# Altium schematic sheet Electromagnetic Detection Board.SchDoc
size A4
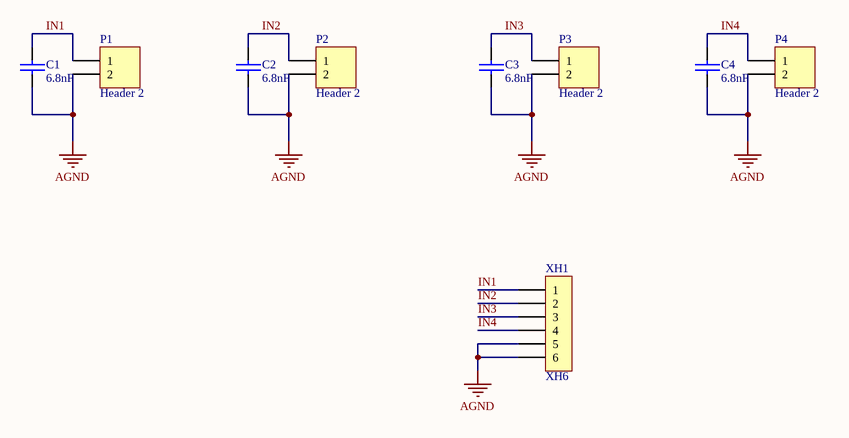
[diagram p0: Electromagnetic Detection Board.SchDoc]

## Parts
C1  6.8nF  [0402C]
C2  6.8nF  [0402C]
C3  6.8nF  [0402C]
C4  6.8nF  [0402C]
P1  Header 2  [HDR1X2]
P2  Header 2  [HDR1X2]
P3  Header 2  [HDR1X2]
P4  Header 2  [HDR1X2]
XH1  XH6  [XH6/2.54mm/180]

## Nets
AGND: C1.1 C2.1 C3.1 C4.1 P1.2 P2.2 P3.2 P4.2 XH1.5 XH1.6
IN1: C1.2 P1.1 XH1.1
IN2: C2.2 P2.1 XH1.2
IN3: C3.2 P3.1 XH1.3
IN4: C4.2 P4.1 XH1.4

## Library data of the parts
C1-C4 = CAP: 无极性电容
P1-P4 = Header 2: Header, 2-Pin; LatestRevisionDate: 17-Jul-2002; LatestRevisionNote: Re-released for DXP Platform.; Publisher: Altium Limited